# Altium schematic sheet SDRAM.SchDoc
size A4
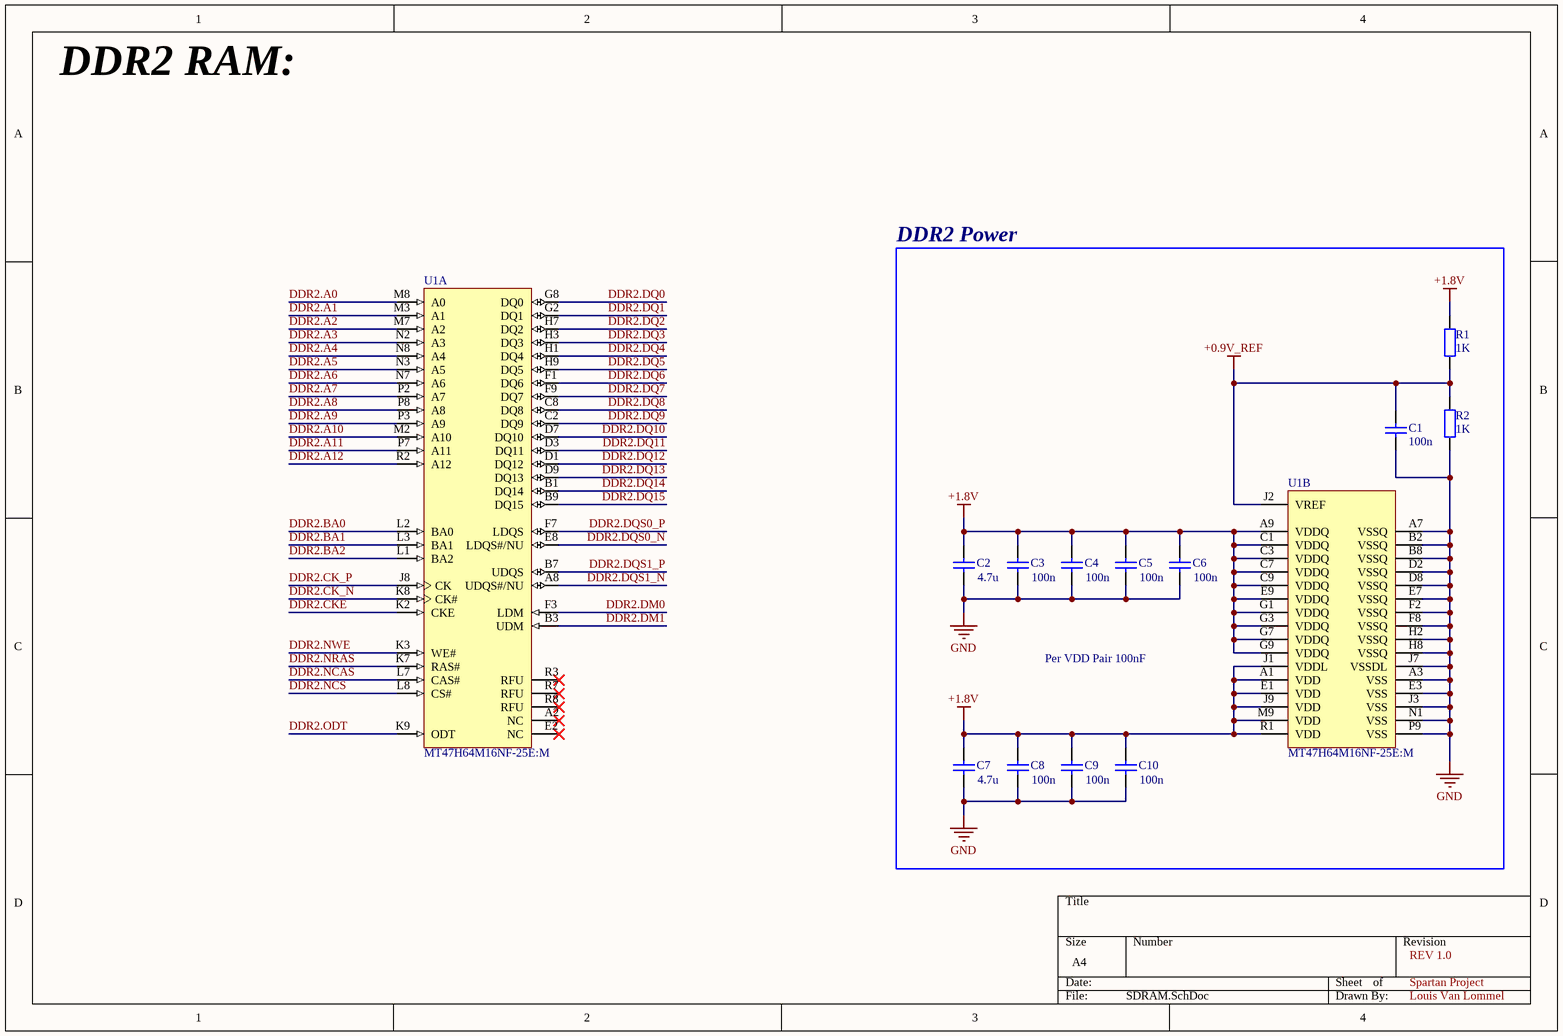
[diagram p0: SDRAM.SchDoc]

## Parts
C1  value 100n  [CAP_0603]
C2  value 4.7u
C3  value 100n  [CAP_0603]
C4  value 100n  [CAP_0603]
C5  value 100n  [CAP_0603]
C6  value 100n  [CAP_0603]
C7  value 4.7u
C8  value 100n  [CAP_0603]
C9  value 100n  [CAP_0603]
C10  value 100n  [CAP_0603]
R1  value 1K  [RES_0603]
R2  value 1K  [RES_0603]
U1  MT47H64M16NF-25E:M  [MICT-NF-84]  (parts A,B of 2)

## Nets
+0.9V_REF: C1.2 R1.2 R2.2 U1.J2(VREF)
+1.8V: C2.2 C3.2 C4.2 C5.2 C6.2 C7.2 C8.2 C9.2 C10.2 R1.1 U1.A1(VDD) U1.A9(VDDQ) U1.C1(VDDQ) U1.C3(VDDQ) U1.C7(VDDQ) U1.C9(VDDQ) U1.E1(VDD) U1.E9(VDDQ) U1.G1(VDDQ) U1.G3(VDDQ) U1.G7(VDDQ) U1.G9(VDDQ) U1.J1(VDDL) U1.J9(VDD) U1.M9(VDD) U1.R1(VDD)
GND: C1.1 C2.1 C3.1 C4.1 C5.1 C6.1 C7.1 C8.1 C9.1 C10.1 R2.1 U1.A3(VSS) U1.A7(VSSQ) U1.B2(VSSQ) U1.B8(VSSQ) U1.D2(VSSQ) U1.D8(VSSQ) U1.E3(VSS) U1.E7(VSSQ) U1.F2(VSSQ) U1.F8(VSSQ) U1.H2(VSSQ) U1.H8(VSSQ) U1.J3(VSS) U1.J7(VSSDL) U1.N1(VSS) U1.P9(VSS)
DDR2.A0: U1.M8(A0)
DDR2.A1: U1.M3(A1)
DDR2.A2: U1.M7(A2)
DDR2.A3: U1.N2(A3)
DDR2.A4: U1.N8(A4)
DDR2.A5: U1.N3(A5)
DDR2.A6: U1.N7(A6)
DDR2.A7: U1.P2(A7)
DDR2.A8: U1.P8(A8)
DDR2.A9: U1.P3(A9)
DDR2.A10: U1.M2(A10)
DDR2.A11: U1.P7(A11)
DDR2.A12: U1.R2(A12)
DDR2.BA0: U1.L2(BA0)
DDR2.BA1: U1.L3(BA1)
DDR2.BA2: U1.L1(BA2)
DDR2.CK_N: U1.K8(CK#)
DDR2.CK_P: U1.J8(CK)
DDR2.CKE: U1.K2(CKE)
DDR2.DM0: U1.F3(LDM)
DDR2.DM1: U1.B3(UDM)
DDR2.DQ0: U1.G8(DQ0)
DDR2.DQ1: U1.G2(DQ1)
DDR2.DQ2: U1.H7(DQ2)
DDR2.DQ3: U1.H3(DQ3)
DDR2.DQ4: U1.H1(DQ4)
DDR2.DQ5: U1.H9(DQ5)
DDR2.DQ6: U1.F1(DQ6)
DDR2.DQ7: U1.F9(DQ7)
DDR2.DQ8: U1.C8(DQ8)
DDR2.DQ9: U1.C2(DQ9)
DDR2.DQ10: U1.D7(DQ10)
DDR2.DQ11: U1.D3(DQ11)
DDR2.DQ12: U1.D1(DQ12)
DDR2.DQ13: U1.D9(DQ13)
DDR2.DQ14: U1.B1(DQ14)
DDR2.DQ15: U1.B9(DQ15)
DDR2.DQS0_N: U1.E8(LDQS#/NU)
DDR2.DQS0_P: U1.F7(LDQS)
DDR2.DQS1_N: U1.A8(UDQS#/NU)
DDR2.DQS1_P: U1.B7(UDQS)
DDR2.NCAS: U1.L7(CAS#)
DDR2.NCS: U1.L8(CS#)
DDR2.NRAS: U1.K7(RAS#)
DDR2.NWE: U1.K3(WE#)
DDR2.ODT: U1.K9(ODT)

Not connected (* = marked no-connect by the designer): U1 A2(NC)* E2(NC)* R3(RFU)* R7(RFU)* R8(RFU)*

## Notes on the sheet
- DDR2 RAM:
- DDR2 Power
- Per VDD Pair 100nF
- REV 1.0
- Spartan Project
- Louis Van Lommel

## Library data of the parts
C1-C10 = Cap: Capacitor; Published: 8-Jun-2000; LatestRevisionDate: 17-Jul-2002; LatestRevisionNote: Re-released for DXP Platform.; PackageReference: RAD-0.3; Publisher: Altium Limited; PackageDescription: Radial Cap, Thru-Hole; 2 Leads; 0.3 in Pin Spacing
R1 R2 = Res2: Resistor; Published: 8-Jun-2000; LatestRevisionDate: 17-Jul-2002; LatestRevisionNote: Re-released for DXP Platform.; PackageReference: AXIAL-0.4; Publisher: Altium Limited; PackageDescription: Axial Device, Thru-Hole; 2 Leads; 0.4 in Pin Spacing
U1 = CMP-2000-05230-1: 1 Gb DDR2-800 SDRAM, 64 Mb x 16, 2.5 ns, 1.8 V, 0 to 85 degC, 84-Ball FBGA, Pb-Free; Manufacturer: Micron; Screening Level: Commercial; Maximum Random Access Time: 0.4ns; Density: 1Gb; Maximum Clock Rate: 400MHz; Data Bus Width: 16Bit; Max Processing Temp: 260; Lead Finish: Tin; Organization: 64Mx16; Operating Supply Voltage: 1.8V; Datasheet URL: https://www.micron.com/~/media/documents/products/data-sheet/dram/ddr2/1gb_ddr2.pdf; Operating Temperature: 0to85C; Package Reference: NF84; Manufacturer URL: https://www.micron.com/; Number of I/O Lines: 16Bit; Mounting: SurfaceMount; Package Description: 84-Ball Ball Grid Array, Body 12.5 x 8 mm, Pitch 0.8 mm; Address Bus Width: 16Bit; Type: DDR2SDRAM; Datasheet Version: Rev. AA, 07/2014; Number of Bits per Word: 16Bit